# EAGLE design ledstringpowerRev1 (EAGLE 9.6.2)
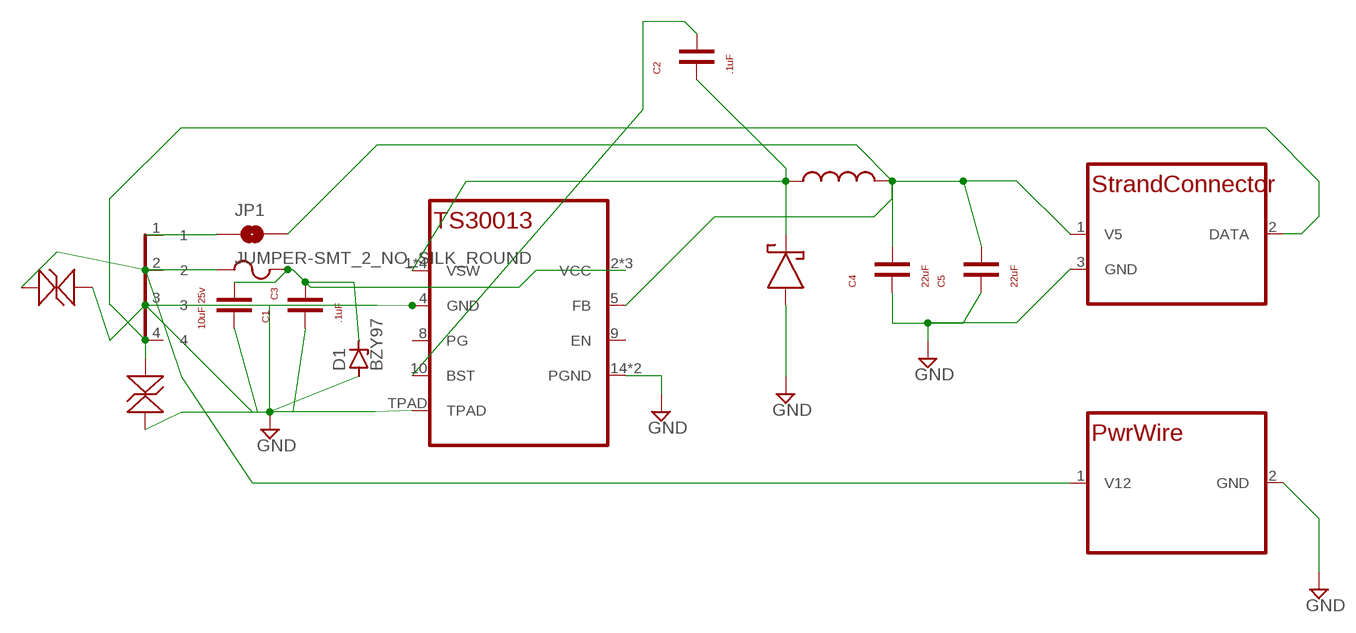
[diagram p0: schematic, sheet 1]

## Parts
C1  .1uF  CAPACITOR_NONPOLARC0603  [C0603]
C2  .1uF  CAPACITOR_NONPOLARC0603  [C0603]
C3  10uF 25v  CL31A106MAHNNNEC1206  [C1206]
C4  22uF  GRM188R61A226ME15DC0603  [C0603]
C5  22uF  GRM188R61A226ME15DC0603  [C0603]
D1  BZY97  [F126Z12]
D2  LS54LS54  [LS54]
F1  3A  FUSER0603  [R0603]
IC1  TS30013QFN16  [QFN16]
JP1  JUMPER-SMT_2_NO_SILK_ROUND  [SMT-JUMPER_2_NO_SILK_ROUND]
L1  SRN5040TA-4R7MSRN5040TA  [SRN5040TA]
TVS1  DESD5V0U1BL-7BDFN1006-2  [DFN1006-2]
TVS2  DESD5V0U1BL-7BDFN1006-2  [DFN1006-2]
U$3  TE-1969806-1TE-1969806-1  [TE-1969806-1]
U$5  LEDSTRANDDLEDWIREP  [LEDWIREP]
U$8  PWRWIREDPWRWIREP  [PWRWIREP]

## Nets
DATA: TVS2.2 U$3.4 U$5.2(DATA)
GND: C1.1 C3.2 C4.1 C5.1 D1.A D2.1 IC1.4(GND) IC1.14(PGND) IC1.15(PGND) IC1.TPAD TVS1.1 TVS2.1 U$3.3 U$5.3(GND) U$8.2(GND)
N$3: C2.1 D2.2 IC1.1(VSW) IC1.12(VSW) IC1.13(VSW) IC1.16(VSW) L1.1
N$5: C2.2 IC1.10(BST)
N$7: JP1.1 U$3.1
V5: C4.2 C5.2 IC1.5(FB) JP1.2 L1.2 U$5.1(V5)
V12: F1.1 TVS1.2 U$3.2 U$8.1(V12)
VCC: C1.2 C3.1 D1.C F1.2 IC1.2(VCC) IC1.3(VCC) IC1.11(VCC)
Unconnected: IC1.8(PG) IC1.9(EN)

## Library data of the parts
C1 C2 = ledinlinesupply:CAPACITOR_NONPOLAR
C3 = ledinlinesupply:CL31A106MAHNNNE
C4 C5 = ledinlinesupply:GRM188R61A226ME15D
D1 = diode:BZY97: Z DIODE
D2 = ledinlinesupply:LS54
F1 = ledinlinesupply:FUSE
IC1 = ledinlinesupply1:TS30013
JP1 = SparkFun-Jumpers:JUMPER-SMT_2_NO: Normally open jumper This jumper has two pads in close proximity to each other. Apply solder to close the connection. Round pads are easier to solder for beginners, but are a lot larger. SparkFun Product that uses the round pads: SparkFun EL Sequencer <https://www.sparkfun.com/products/12781>
L1 = ledinlinesupply:SRN5040TA-4R7M
TVS1 TVS2 = ledinlinesupply:DESD5V0U1BL-7B
U$3 = ledinlinesupply:TE-1969806-1
U$5 = ledinlinesupply:LEDSTRANDD
U$8 = ledinlinesupply:PWRWIRED

## Board
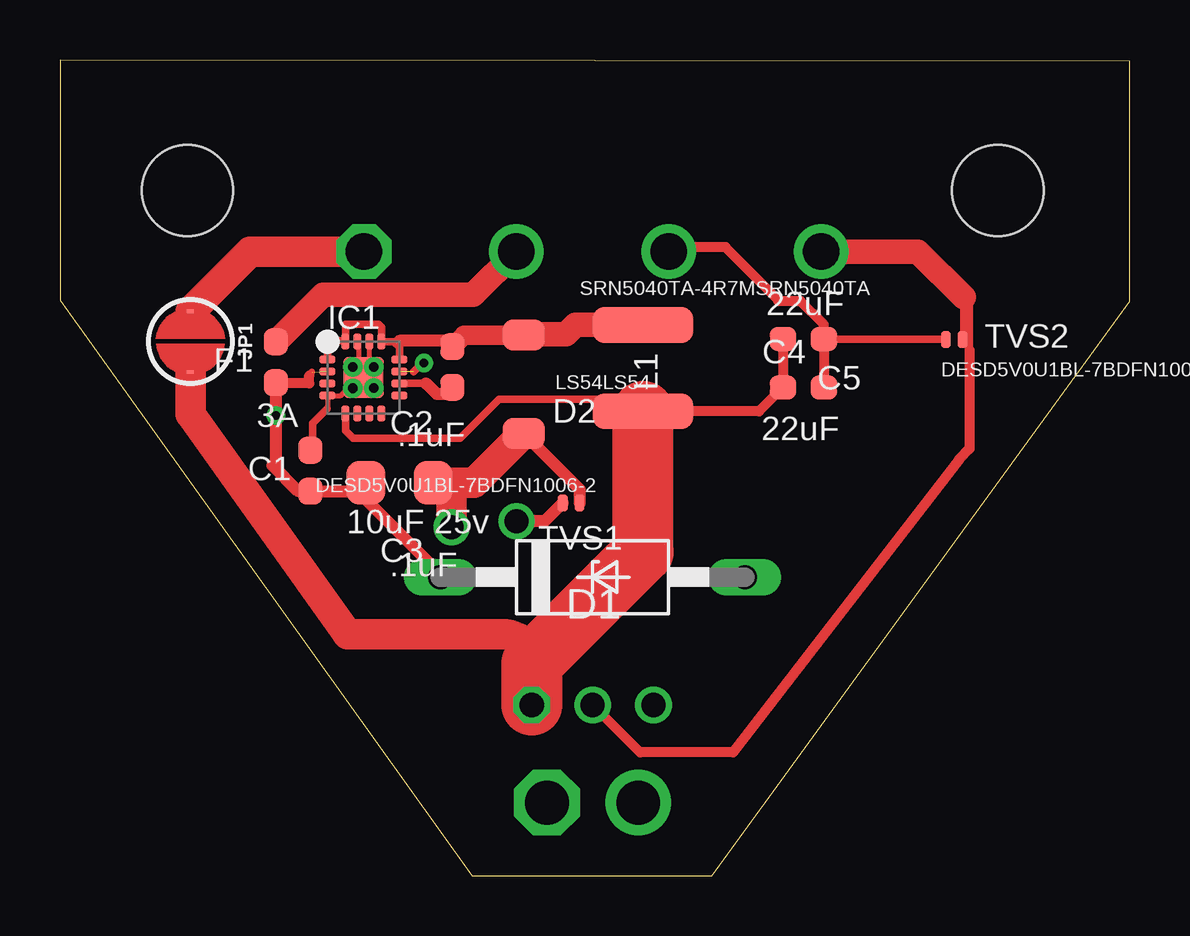
[diagram p1: board, top side]
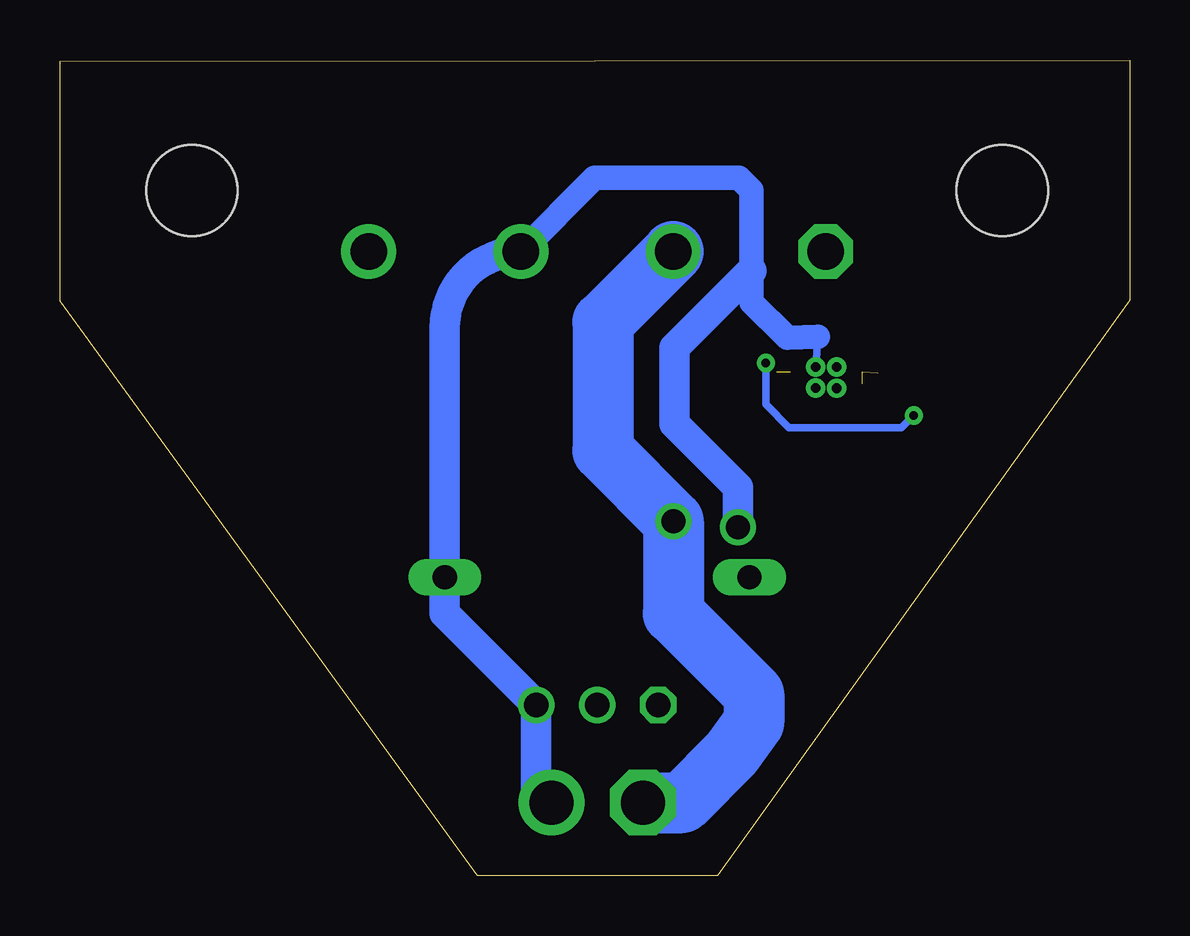
[diagram p2: board, bottom side, seen from below]

Size 44.59 x 33.99 mm. Coordinates in mm from the lower left corner, seen from the top.
Outline: 17.18,0 27.18,0 44.59,23.93 44.59,33.93 0,33.99 0,23.99 17.18,0
Copper layers (1*16): Top 0.035mm / dielectric 1.5mm / Bottom 0.035mm
Design rules "default": minimum track width 6mil, minimum drill 0.35mm, track to track 6mil, track to pad 6mil, pad to pad 6mil, via to via 6mil, smd to smd 6mil, copper to edge 40mil, drill to drill 6mil, minimum pad ring 10mil, minimum via ring 8mil, stop-mask expansion 4mil, vias tented up to drill 0mil, thermal gap 10mil

### Footprints (pad centres in the part's own frame; a part is rotated, then mirrored left to right if it is on the bottom)
C0603 = smd 1.1 x 1: 1 -0.85,0; 2 0.85,0
C1206 = smd 1.6 x 1.8: 1 -1.4,0; 2 1.4,0
F126Z12 = drill 1.016 long: A 6.35,0; C -6.35,0
LS54 = smd 1.3 x 1.75: 1 -2.05,0; 2 2.05,0
R0603 = smd 1.1 x 1: 1 -0.85,0; 2 0.85,0
QFN16 = smd 0.65 x 0.34: 1 -1.5,0.75; 2 -1.5,0.25; 3 -1.5,-0.25; 4 -1.5,-0.75; 9 1.5,-0.75; 10 1.5,-0.25; 11 1.5,0.25; 12 1.5,0.75 | smd 0.34 x 0.65: 5 -0.75,-1.5; 6 -0.25,-1.5; 7 0.25,-1.5; 8 0.75,-1.5; 13 0.75,1.5; 14 0.25,1.5; 15 -0.25,1.5; 16 -0.75,1.5 | smd 1.7 x 1.7: TPAD 0,0
SMT-JUMPER_2_NO_SILK_ROUND = smd 0.152 x 0.305: 1 -1.27,0; 2 1.27,0
SRN5040TA = smd 1.5 x 4.2: 1 -1.8,0; 2 1.8,0
DFN1006-2 = smd 0.4 x 0.7: 1 -0.35,0; 2 0.35,0
TE-1969806-1 = drill 1.52 octagon: 1 -9.525,0 | drill 1.52: 2 -3.175,0; 3 3.175,0; 4 9.525,0 | hole 3.81: -16.89,2.54; 16.89,2.54
LEDWIREP = drill 1.016 octagon: 1 -2.54,0 | drill 1.016: 2 0,0; 3 2.54,0
PWRWIREP = drill 1.829 octagon: 1 -1.905,0 | drill 1.829: 2 1.905,0

### Placement (x,y rotation side)
C1  10.44,16.88 270 top
C2  16.36,21.2 270 top
C3  14.15,16.37 0 top
C4  30.99,20.35 180 top
C5  30.99,22.36 180 top
D1  22.2,12.44 0 top
D2  19.33,20.48 90 top
F1  9,21.4 270 top
IC1  12.65,20.76 0 top
JP1  5.44,22.26 270 top
L1  24.31,21.15 270 top
TVS1  21.31,15.54 180 top
TVS2  37.28,22.35 0 top
U$3  22.2,26.01 0 top
U$5  22.2,7.12 0 top
U$8  22.2,3.05 0 top

### Tracks (layer width: path | path; a pad name or v marks a point on that pad's centre or on a via)
DATA
  Top 0.305: TVS2.2 37.67,22.39 37.67,24.11 37.91,23.87 37.91,21.9
  Top 0.406: 37.91,21.9 37.91,17.79 37.48,17.36 28.06,5.14 24.18,5.14 U$5.2
  Top 1.016: U$3.4 35.77,26.01 37.67,24.11
GND  (via drill 0.4, 1)
  Top 0.152: IC1.TPAD v12.21,20.32 v12.21,20.31 | IC1.TPAD v13.09,21.2 | IC1.TPAD v13.08,20.33 v13.09,20.33 | 12.22,21.2 12.22,21.08 12.53,20.83 IC1.TPAD
  Top 0.2: 12.45,20.76 IC1.TPAD | 12.45,20.76 11.7,20.01 IC1.4 11.15,19.47 11.14,19.46 | IC1.15 12.45,22.21 12.45,20.76 | v13.09,21.2 12.89,21.4 IC1.14
  Top 0.254: v12.21,21.2 12.21,20.76 IC1.TPAD 12.22,20.76 12.22,21.2
  Top 0.305: 11.14,19.46 10.54,18.86 10.54,17.83 C1.1 | TVS2.1 C5.1
  Top 0.406: U$3.3 25.56,26.19 27.74,26.19 29.94,23.99 29.94,23.94 30.87,23.94 31.84,22.97 C5.1 C4.1
  Top 0.508: D2.1 21.66,16.1 TVS1.1
  Top 1.27: D2.1 17.27,16.38 16.27,16.38 | 16.27,16.38 C3.2 | v16.32,14.53 16.32,16.33 16.27,16.38
  Bottom 0.305: 12.99,22.46 v13.09,21.2
  Bottom 1.016: 12.99,22.46 14.26,22.42 15.76,23.89 15.76,25.21 15.76,28.56 16.28,29.08 22.31,29.08 U$3.3
  Bottom 1.27: U$8.2 arc90 24.74,3.69 U$5.3 28.55,10.93 D1.A 28.55,22.84 arc90 U$3.3 | 16.32,15.45 v16.32,14.53 16.32,16.18 18.97,18.83 18.97,22 15.76,25.21
N$3
  Top 0.305: IC1.1 11.15,22.27 11.17,22.29 11.87,22.29 IC1.16 11.9,22.97 13.29,22.97 13.4,22.86 IC1.13 13.91,22.26 14.15,22.02 | 14.15,22.29 14.15,22.02 | 14.15,22.02 IC1.12
  Top 0.508: C2.1 16.12,22.29 14.15,22.29
  Top 0.813: D2.2 16.84,22.53 C2.1
  Top 1.016: L1.1 21.49,22.95 21.1,22.56 19.36,22.56 D2.2
N$5
  Top 0.305: 15.26,20.52 14.43,20.52 14.42,20.51 IC1.10
  Top 0.508: C2.2 16.08,20.07 15.71,20.07 15.26,20.52
N$7
  Top 1.27: U$3.1 7.92,26.01 JP1.1
V5
  Top 0.305: IC1.5 11.9,18.55 12.21,18.24 16.68,18.24 18.3,19.86 23.8,19.86 L1.2
  Top 0.406: C5.2 C4.2 29.14,19.35 L1.2
  Top 1.27: 19.66,8.84 19.68,8.86 arc90 18.47,10.07 12,10.07 5.44,19.23 JP1.2
  Top 2.54: 19.68,8.86 24.31,13.49 L1.2 | 19.66,8.84 U$5.1
V12  (via drill 1)
  Top 0.508: TVS1.2 20.2,14.78 v19.03,14.78
  Top 1.016: F1.1 10.96,24.21 17.22,24.21 U$3.2
  Bottom 2.54: U$3.2 21.96,23.07 21.96,17.72 v19.03,14.78 19.03,10.94 15.67,7.58 15.67,6.38 16.54,5.16 18.65,3.05 U$8.1
VCC  (via drill 0.35)  (3 unrouted)
  Top 0.2: 10.39,20.51 10.42,20.48 | 10.26,20.53 10.38,20.53 10.38,20.84 10.39,20.85 10.5,20.96
  Top 0.254: 10.5,20.96 10.5,21.01 | 10.42,20.51 10.42,20.48
  Top 0.305: 14.73,21.01 15.09,21.36 v15.17,21.36
  Top 0.406: F1.2 10.24,20.55 10.26,20.53 | 10.39,20.51 10.39,20.85
  Top 0.508: 12.41,16.03 C1.2 9.93,16.03 8.86,17.1 9,17.24 v9,19.18 F1.2 | 12.41,16.03 C3.1 | 12.41,16.03 15.85,12.59 D1.C
  Bottom 0.305: v15.17,21.36 15.17,19.64 14.2,18.67 9.51,18.67 v9,19.18